# EAGLE schematic board (EAGLE 8.6.0)
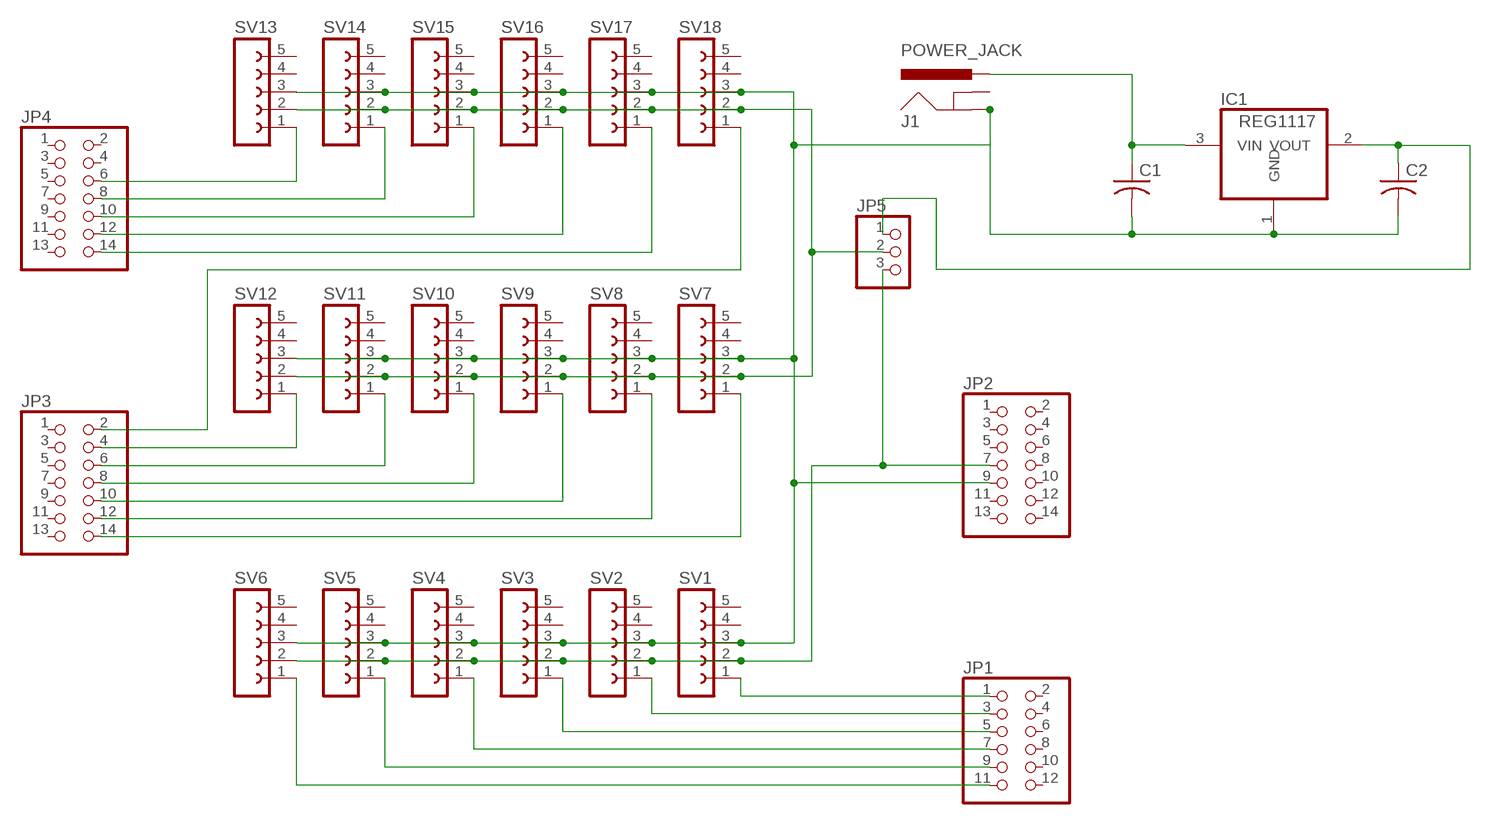
[diagram p0: schematic, sheet 1]

## Parts
C1  C-US025-024X044  [C025-024X044]
C2  C-US025-024X044  [C025-024X044]
IC1  REG1117  [SOT223]
J1  POWER_JACK  [POWER_JACK_PTH]
JP1  PINHD-2X6  [2X06]
JP2  PINHD-2X7  [2X07]
JP3  PINHD-2X7  [2X07]
JP4  PINHD-2X7  [2X07]
JP5  PINHD-1X3  [1X03]
SV1  FE05-1  [FE05-1]
SV2  FE05-1  [FE05-1]
SV3  FE05-1  [FE05-1]
SV4  FE05-1  [FE05-1]
SV5  FE05-1  [FE05-1]
SV6  FE05-1  [FE05-1]
SV7  FE05-1  [FE05-1]
SV8  FE05-1  [FE05-1]
SV9  FE05-1  [FE05-1]
SV10  FE05-1  [FE05-1]
SV11  FE05-1  [FE05-1]
SV12  FE05-1  [FE05-1]
SV13  FE05-1  [FE05-1]
SV14  FE05-1  [FE05-1]
SV15  FE05-1  [FE05-1]
SV16  FE05-1  [FE05-1]
SV17  FE05-1  [FE05-1]
SV18  FE05-1  [FE05-1]

## Nets
N$1: JP1.1 SV1.1
N$2: JP3.2 SV18.1
N$3: JP1.3 SV2.1
N$4: JP4.14 SV17.1
N$5: JP1.5 SV3.1
N$6: JP1.7 SV4.1
N$7: JP1.9 SV5.1
N$8: JP1.11 SV6.1
N$9: JP3.14 SV7.1
N$10: JP3.12 SV8.1
N$11: JP3.10 SV9.1
N$12: JP3.8 SV10.1
N$13: JP3.6 SV11.1
N$14: JP3.4 SV12.1
N$15: JP4.12 SV16.1
N$16: JP4.10 SV15.1
N$17: C1.2 C2.2 IC1.1(GND) J1.GND JP2.9 SV1.3 SV2.3 SV3.3 SV4.3 SV5.3 SV6.3 SV7.3 SV8.3 SV9.3 SV10.3 SV11.3 SV12.3 SV13.3 SV14.3 SV15.3 SV16.3 SV17.3 SV18.3
N$18: JP5.2 SV7.2 SV8.2 SV9.2 SV10.2 SV11.2 SV12.2 SV13.2 SV14.2 SV15.2 SV16.2 SV17.2 SV18.2
N$19: JP4.8 SV14.1
N$20: JP4.6 SV13.1
N$22: C1.1 IC1.3(VIN) J1.PWR
N$24: JP2.7 JP5.3 SV1.2 SV2.2 SV3.2 SV4.2 SV5.2 SV6.2
N$25: C2.1 IC1.2(VOUT) JP5.1
Unconnected: J1.GNDBREAK JP1.2 JP1.4 JP1.6 JP1.8 JP1.10 JP1.12 JP2.1 JP2.2 JP2.3 JP2.4 JP2.5 JP2.6 JP2.8 JP2.10 JP2.11 JP2.12 JP2.13 JP2.14 JP3.1 JP3.3 JP3.5 JP3.7 JP3.9 JP3.11 JP3.13 JP4.1 JP4.2 JP4.3 JP4.4 JP4.5 JP4.7 JP4.9 JP4.11 JP4.13 SV1.4 SV1.5 SV2.4 SV2.5 SV3.4 SV3.5 SV4.4 SV4.5 SV5.4 SV5.5 SV6.4 SV6.5 SV7.4 SV7.5 SV8.4 SV8.5 SV9.4 SV9.5 SV10.4 SV10.5 SV11.4 SV11.5 SV12.4 SV12.5 SV13.4 SV13.5 SV14.4 SV14.5 SV15.4 SV15.5 SV16.4 SV16.5 SV17.4 SV17.5 SV18.4 SV18.5

## Library data of the parts
C1 C2 = adafruit:C-US: CAPACITOR, American symbol
IC1 = burr-brown:REG1117: 800mA and 1A Low Dropout (LDO) Positive Regulator 1.8V, 2.5V, 2.85V, 3.3V, 5V, and Adj; MPN: REG1117; OC_FARNELL: 1097566; OC_NEWARK: 14P6981
J1 = SparkFun-Connectors:POWER_JACK: Power Jack Connector This is the standard 5.5mm barrel jack for power. The PTH is the most common, proven, reliable, footprint. The Slot footprint only works if the mill layer is transmitted to the PCB fab house so be warned. Here are the connectors we sell at SparkFun: DC Barrel Power Jack/Connector <https://www.sparkfun.com/products/119> (PRT-00119) DC Barrel Power Jack/Connector (SMD) <https://www.sparkfun.com/products/12748> (PRT-12748) DC Barrel Jack Adapter - Breadboard Compatible <https://www.sparkfun.com/products/10811> (PRT-10811) It is used on this SparkFun product (and many, many others): SparkFun RedBoard - Programmed with Arduino <https://www.sparkfun.com/products/12757> (DEV-12757) Also, if you need a mating power supply or connector, please check these out: Wall Adapter Power Supply - 9VDC 650mA <https://www.sparkfun.com/products/298> (TOL-00298) DC Barrel Jack Adapter - Male <https://www.sparkfun.com/products/10287> (PRT-10287); PROD_ID: CONN-08197
JP1 = pinhead:PINHD-2X6: PIN HEADER
JP2-JP4 = pinhead:PINHD-2X7: PIN HEADER
JP5 = adafruit:PINHD-1X3: PIN HEADER
SV1-SV18 = con-lsta:FE05-1: FEMALE HEADER; OC_FARNELL: unknown; OC_NEWARK: unknown